# EAGLE board MainECU rev9 (EAGLE 9.5.0), part 1 of 2
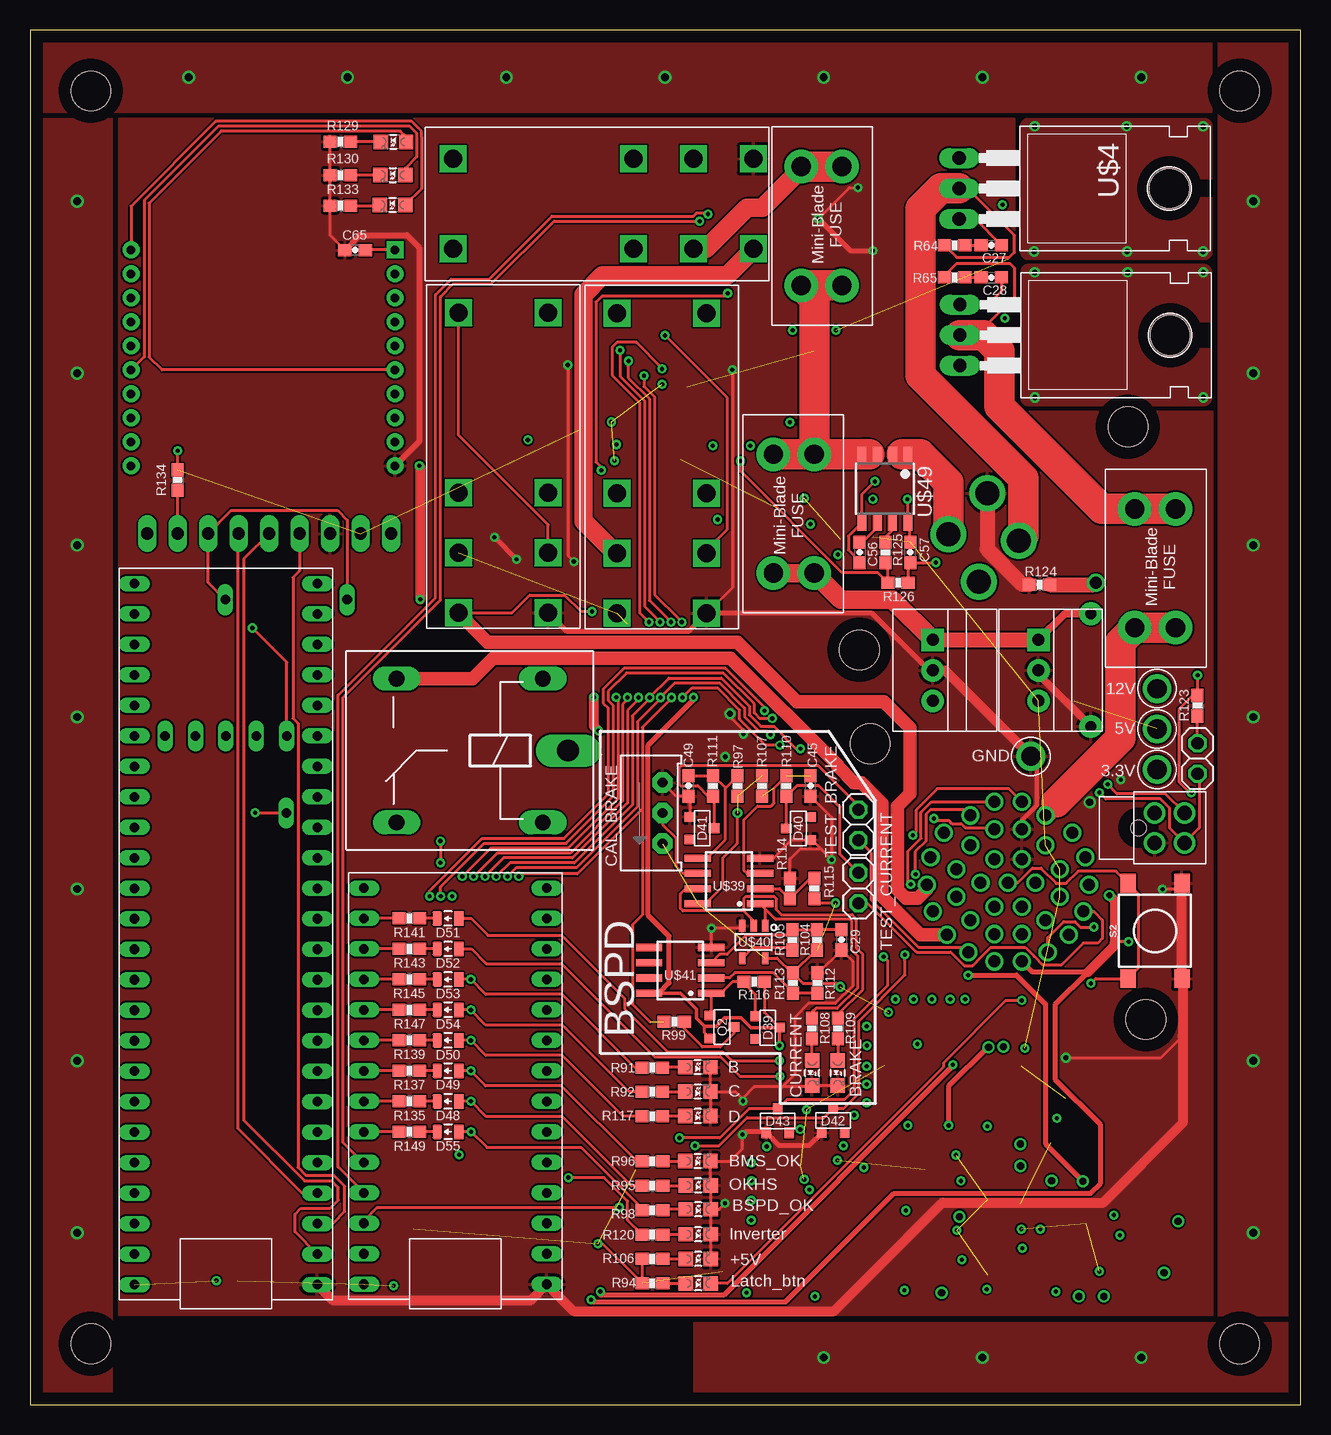
[diagram p4: board, top side]
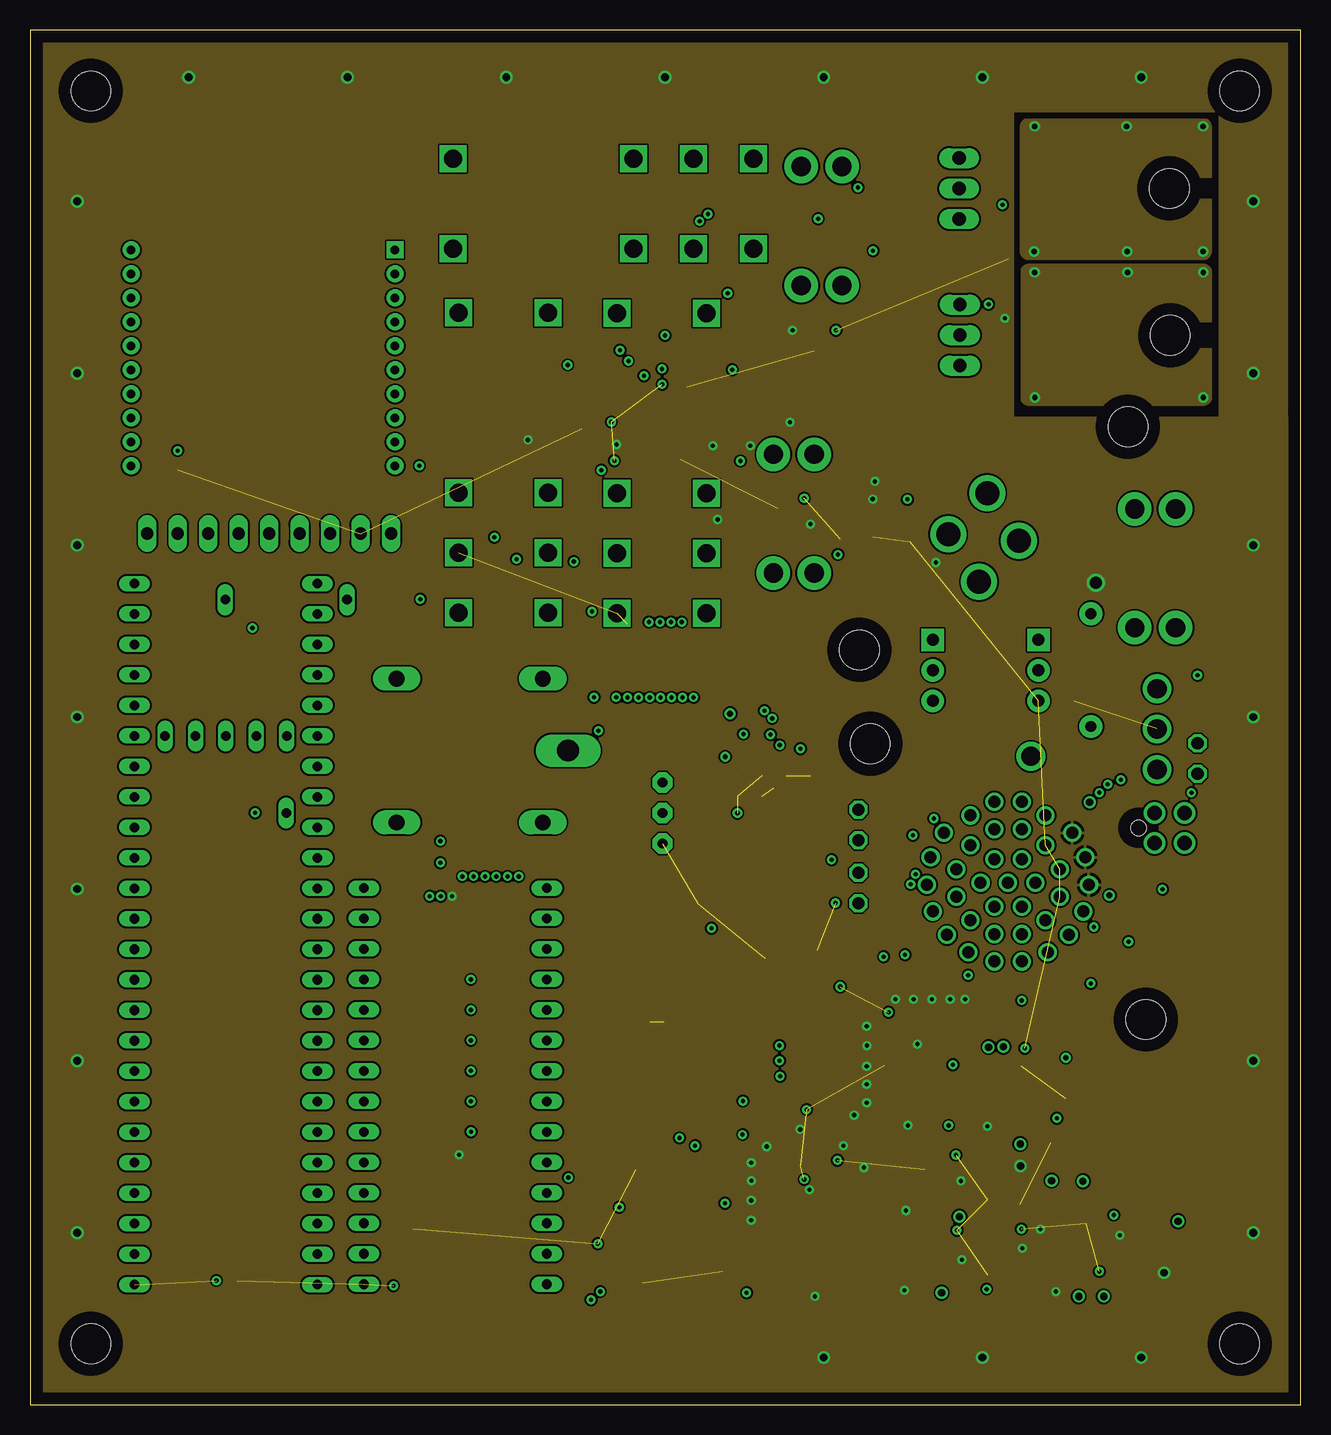
[diagram p5: board, inner layer Route2]
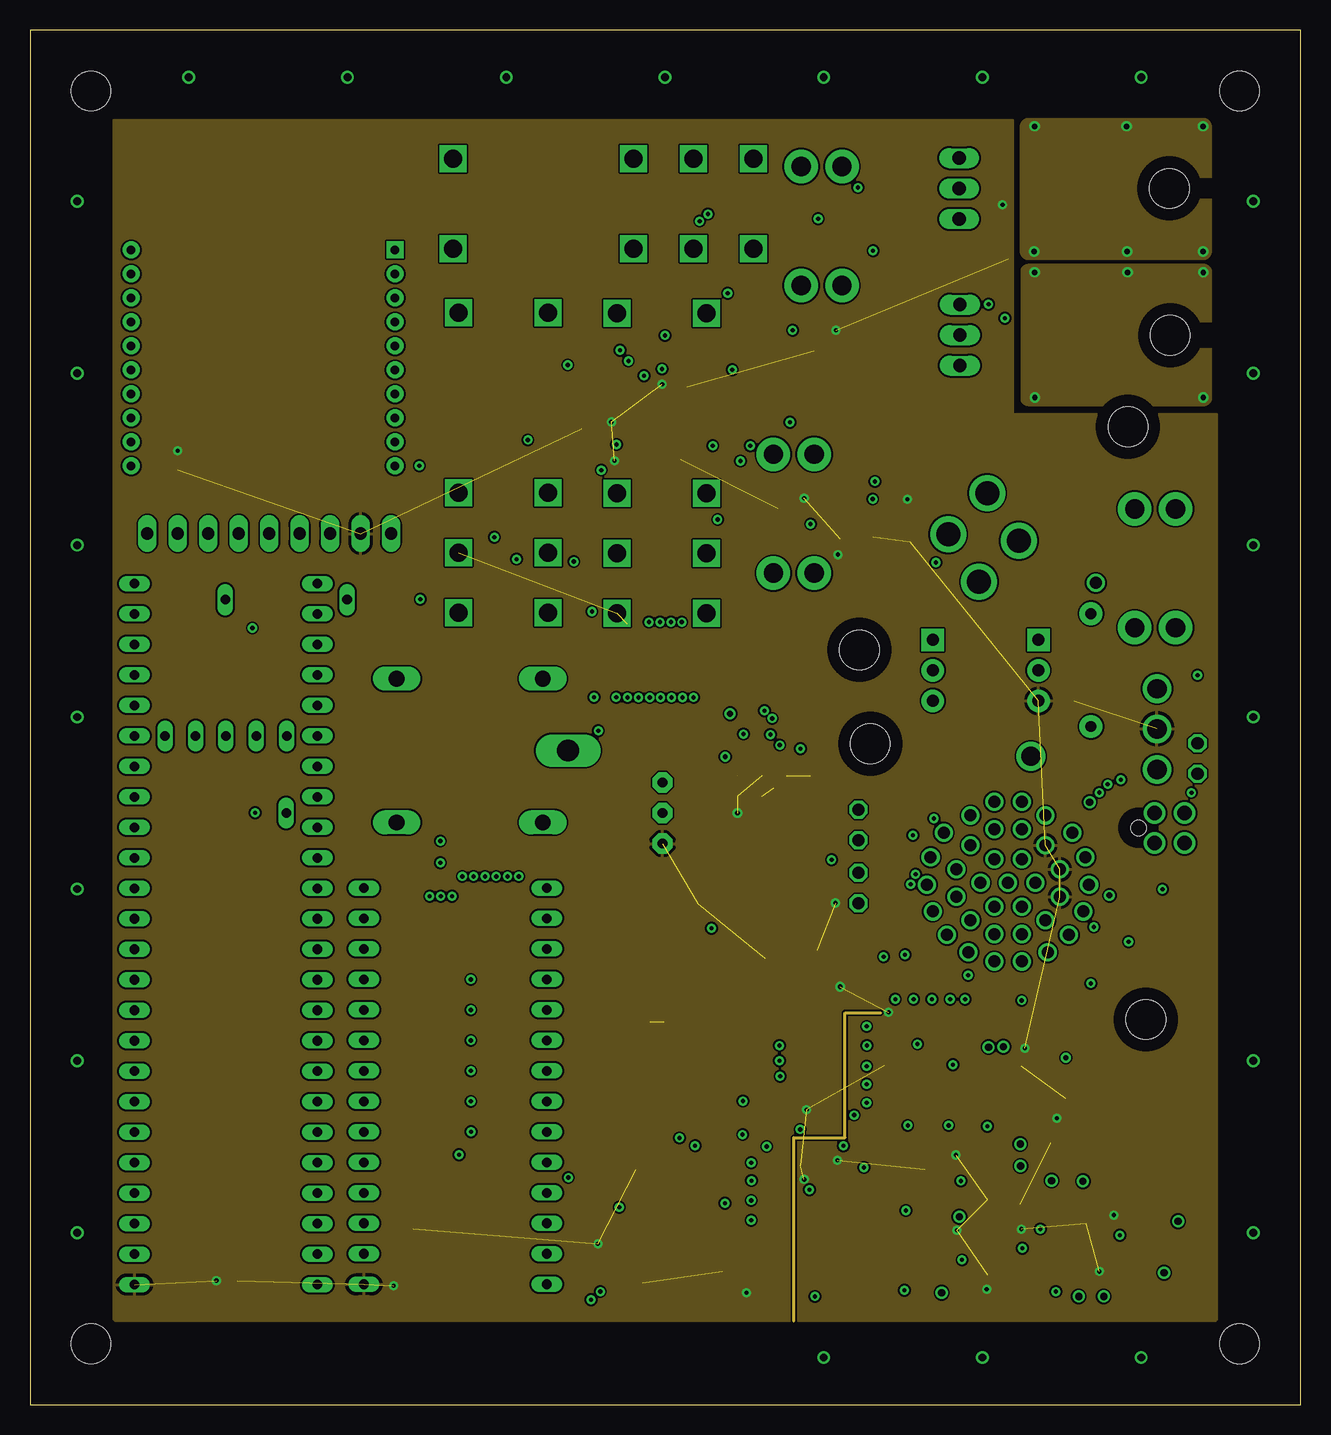
[diagram p6: board, inner layer Route15]
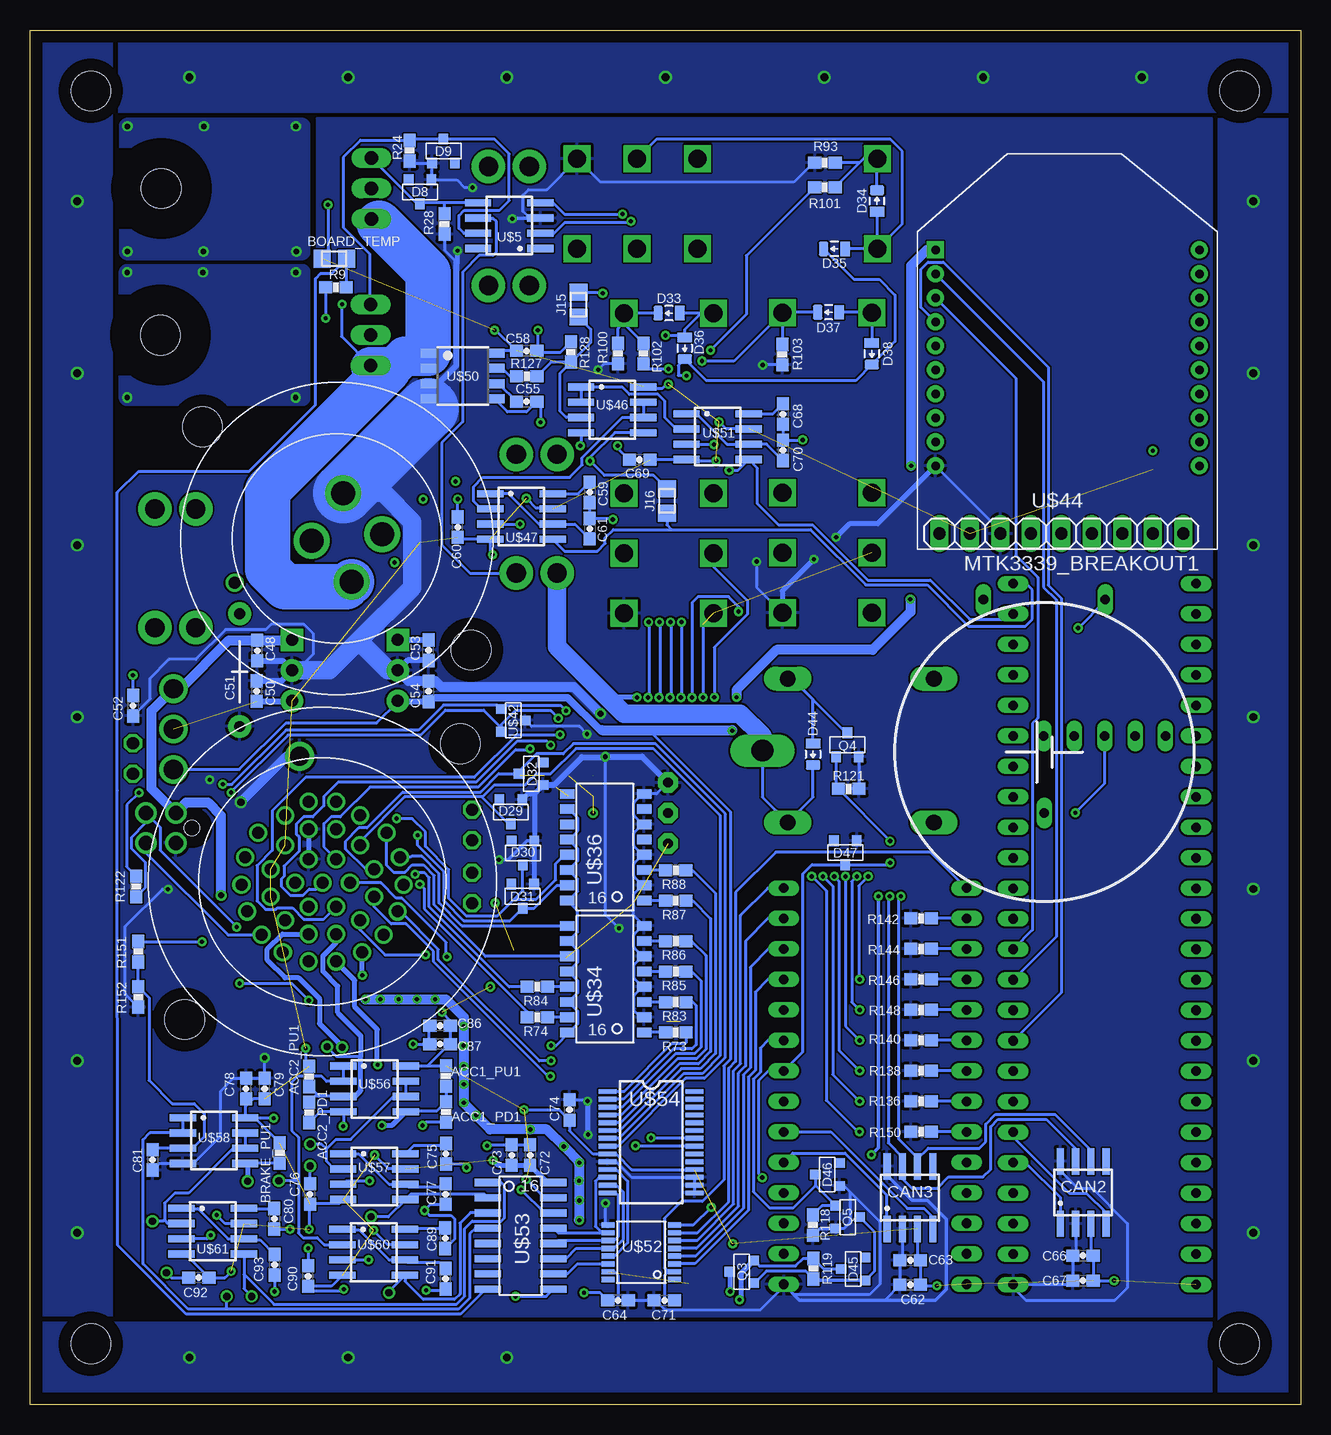
[diagram p7: board, bottom side, seen from below]

Size 105.92 x 114.55 mm. Coordinates in mm from the lower left corner, seen from the top.
Outline: 0,0 105.92,0 105.92,114.55 0,114.55 0,0
Copper layers (1+2*15+16): Top 0.035mm / dielectric 0.18mm / Route2 0.017mm / dielectric 1.12mm / Route15 0.017mm / dielectric 0.18mm / Bottom 0.035mm
Design rules "DRC JLC 4-layer": minimum track width 6mil, minimum drill 10mil, track to track 6mil, track to pad 6mil, pad to pad 6mil, via to via 6mil, smd to smd 6mil, copper to edge 40mil, drill to drill 6mil, minimum pad ring 10mil, minimum via ring 8mil, stop-mask expansion 4mil, vias tented up to drill 0mil, thermal gap 10mil
Holes 3.3 mm at 100.84,5.08 5.08,5.08 5.08,109.47 100.84,109.47

## Footprints (pad centres in the part's own frame; a part is rotated, then mirrored left to right if it is on the bottom)
TEST_POINT = drill 1.6: P$1 0,0
MINI-BLADE_FUSE_HOLDER = drill 1.613 pad 2.794: L1 0,3.404; L2 0,0; R1 9.906,3.404; R2 9.906,0
0603-RES = smd 1.1 x 1: 1 -0.85,0; 2 0.85,0
0805 = smd 1.4 x 1.5: 1 -1.025,0; 2 1.025,0
0603-CAP = smd 1.1 x 1: 1 -0.85,0; 2 0.85,0
CAP-PTH-LARGE = drill 0.9 pad 1.905: 1 -4.826,0; 2 4.572,0
TRIMPOT_3296 = drill 0.813 pad 1.676 octagon: 1 2.54,1.27; 2 0,1.27; 3 -2.54,1.27
SOIC-08 = smd 0.6 x 2.2: 1 -1.905,-2.6; 2 -0.635,-2.6; 3 0.635,-2.6; 4 1.905,-2.6; 5 1.905,2.6; 6 0.635,2.6; 7 -0.635,2.6; 8 -1.905,2.6
1X02_SLIM = drill 1.016 octagon: 1 -1.27,0; 2 1.27,0
SOT23 = smd 0.8 x 0.9: 1 -0.95,-1; 2 0.95,-1; 3 0,1
0805_D = smd 0.8 x 1.2: A -0.9,0; C 0.9,0
RELAY_DPDT = drill 1.5 square: 2 10.008,0; 3 5.004,0; 4 0,0; 5 0,7.493; 6 5.004,7.493; 7 10.008,7.493; COIL+ 25.019,0; COIL- 25.019,7.493
ZF112 = drill 1.321 long: 1 4.064,14.884; 2 4.064,2.896; O 16.256,14.884; S 16.256,2.896 | drill 1.803 long: P 1.956,8.89
LED-805 = smd 1.2 x 1.2: A 0,-1.05; C 0,1.05
1X09 = drill 1.016 long: 1 -8.89,0; 2 -6.35,0; 3 -3.81,0; 4 -1.27,0; 5 1.27,0; 6 3.81,0; 7 6.35,0; 8 8.89,0; 9 11.43,0
OKI-78SR = drill 1 pad 1.88 square: 1 -2.54,0 | drill 1 pad 1.88: 2 0,0; 3 2.54,0
TACTILE_SWITCH_SMD_6.2MM_TALL = smd 1.55 x 1.3: A1 -3.975,-2.25; A2 3.975,-2.25; B1 -3.975,2.25; B2 3.975,2.25
TO-220-H-HOLE = drill 1.118 long: 1 -2.54,-6.35; 2 0,-6.35; 3 2.54,-6.35 | hole 3.302: 0,11.176
11-11F1 = smd 0.8 x 1.2: 1 -4.445,-3.277; 2 -3.175,-3.277; 3 -1.905,-3.277; 4 -0.635,-3.277; 5 0.635,-3.277; 6 1.905,-3.277; 7 3.175,-3.277; 8 4.445,-3.277; 9 4.445,3.15; 10 3.175,3.15; 11 1.905,3.15; 12 0.635,3.15; 13 -0.635,3.15; 14 -1.905,3.15; 15 -3.175,3.15; 16 -4.445,3.15
SOT-23-5 = smd 1 x 0.55: 1 -1.35,0.95; 2 -1.35,0; 3 -1.35,-0.95; 4 1.35,-0.95; 5 1.35,0.95
TEENSY_3.5_EXT = drill 0.8 long: 3.3V 16.51,54.61; 3.3V_1 1.27,24.13; 3.3V_2 6.35,13.97; A0 16.51,29.21; A1 16.51,31.75; A2 16.51,34.29; A3 16.51,36.83; A4 16.51,39.37; A5 16.51,41.91; A6 16.51,44.45; A7 16.51,46.99; A8 16.51,49.53; A9 16.51,52.07; A12 1.27,3.81; A13 1.27,1.27; A14 16.51,1.27; A15 16.51,3.81; A16 16.51,6.35; A17 16.51,8.89; A18 16.51,11.43; A19 16.51,13.97; A20 16.51,16.51; A21 16.51,19.05; A22 16.51,21.59; AGND 16.51,57.15; D0(RX1) 1.27,57.15; D1(TX1) 1.27,54.61; D2 1.27,52.07; D3(CANTX) 1.27,49.53; D4(CANRX) 1.27,46.99; D5 1.27,44.45; D6 1.27,41.91; D7(RX3) 1.27,39.37; D8(TX3) 1.27,36.83; D9(RX2) 1.27,34.29; D10(TX2) 1.27,31.75; D11 1.27,29.21; D12 1.27,26.67; D13 16.51,26.67; D24 1.27,21.59; D25 1.27,19.05; D26 1.27,16.51; D27 1.27,13.97; D28 1.27,11.43; D29 1.27,8.89; D30 1.27,6.35; GND 1.27,59.69; GND_1 16.51,24.13; GND_2 8.89,13.97; PROG 11.43,13.97; RST 13.97,13.97; VBAT 3.81,13.97; VIN 16.51,59.69
XBEE = drill 0.7 pad 1.422 square: 1 -11,5.5 | drill 0.7 pad 1.422: 2 -11,3.5; 3 -11,1.5; 4 -11,-0.5; 5 -11,-2.5; 6 -11,-4.5; 7 -11,-6.5; 8 -11,-8.5; 9 -11,-10.5; 10 -11,-12.5; 11 11,-12.5; 12 11,-10.5; 13 11,-8.5; 14 11,-6.5; 15 11,-4.5; 16 11,-2.5; 17 11,-0.5; 18 11,1.5; 19 11,3.5; 20 11,5.5
CR-2450/G1AN = drill 0.8 long: +_0 -5.08,12.7; +_1 5.08,12.7; - 0,-5.08
TEENSY_3.2_SIMPLE = drill 0.8 long: 3.3V 16.51,29.21; A0 16.51,3.81; A1 16.51,6.35; A2 16.51,8.89; A3 16.51,11.43; A4 16.51,13.97; A5 16.51,16.51; A6 16.51,19.05; A7 16.51,21.59; A8 16.51,24.13; A9 16.51,26.67; AGND 16.51,31.75; D0(RX1) 1.27,31.75; D1(TX1) 1.27,29.21; D2 1.27,26.67; D3(CANTX) 1.27,24.13; D4(CANRX) 1.27,21.59; D5 1.27,19.05; D6 1.27,16.51; D7(RX3) 1.27,13.97; D8(TX3) 1.27,11.43; D9(RX2) 1.27,8.89; D10(TX2) 1.27,6.35; D11 1.27,3.81; D12 1.27,1.27; D13 16.51,1.27; GND 1.27,34.29; VIN 16.51,34.29
SOP8 = smd 0.76 x 1.27: 1 -1.905,-2.86; 2 -0.635,-2.86; 3 0.635,-2.86; 4 1.905,-2.86; 5 1.905,2.86; 6 0.635,2.86; 7 -0.635,2.86; 8 -1.905,2.86
TSSOP-16 = smd 0.45 x 1.1: 1 -2.275,-2.618; 2 -1.625,-2.618; 3 -0.975,-2.618; 4 -0.325,-2.618; 5 0.325,-2.618; 6 0.975,-2.618; 7 1.625,-2.618; 8 2.275,-2.618; 9 2.275,2.918; 10 1.625,2.918; 11 0.975,2.918; 12 0.325,2.918; 13 -0.325,2.918; 14 -0.975,2.918; 15 -1.625,2.918; 16 -2.275,2.918
SOIC-16 = smd 0.6 x 2.2: 1 -4.445,-2.794; 2 -3.175,-2.794; 3 -1.905,-2.794; 4 -0.635,-2.794; 5 0.635,-2.794; 6 1.905,-2.794; 7 3.175,-2.794; 8 4.445,-2.794; 9 4.445,2.667; 10 3.175,2.667; 11 1.905,2.667; 12 0.635,2.667; 13 -0.635,2.667; 14 -1.905,2.667; 15 -3.175,2.667; 16 -4.445,2.667
SSOP28 = smd 0.4 x 1.5: 1 -4.225,-3.625; 2 -3.575,-3.625; 3 -2.925,-3.625; 4 -2.275,-3.625; 5 -1.625,-3.625; 6 -0.975,-3.625; 7 -0.325,-3.625; 8 0.325,-3.625; 9 0.975,-3.625; 10 1.625,-3.625; 11 2.275,-3.625; 12 2.925,-3.625; 13 3.575,-3.625; 14 4.225,-3.625; 15 4.225,3.625; 16 3.575,3.625; 17 2.925,3.625; 18 2.275,3.625; 19 1.625,3.625; 20 0.975,3.625; 21 0.325,3.625; 22 -0.325,3.625; 23 -0.975,3.625; 24 -1.625,3.625; 25 -2.275,3.625; 26 -2.925,3.625; 27 -3.575,3.625; 28 -4.225,3.625
AUTOSPORT_14-35 = drill 1: P$1 1.143,6.655; P$2 3.124,5.512; P$3 5.359,4.064; P$4 6.452,2.032; P$5 6.756,-0.254; P$6 6.274,-2.489; P$7 5.08,-4.445; P$8 3.302,-5.893; P$9 1.143,-6.655; P$10 -1.143,-6.655; P$11 -3.302,-5.893; P$12 -5.08,-4.445; P$13 -6.274,-2.489; P$14 -6.756,-0.254; P$15 -6.452,2.032; P$16 -5.359,4.064; P$17 -3.124,5.512; P$18 -1.143,6.655; P$19 1.143,4.369; P$20 3.124,3.023; P$21 4.318,1.016; P$22 4.318,-1.27; P$23 3.124,-3.226; P$24 1.143,-4.369; P$25 -1.143,-4.369; P$26 -3.124,-3.226; P$27 -4.318,-1.27; P$28 -4.318,1.016; P$29 -3.124,3.023; P$30 -1.143,4.369; P$31 1.143,1.88; P$32 2.286,-0.102; P$33 1.143,-2.083; P$34 -1.143,-2.083; P$35 -2.286,-0.102; P$36 -1.143,1.88; P$37 0,-0.102 | hole 3.3: -11.491,-11.491; 11.491,11.491
AUTOSPORT_12-04 = drill 2: P$1 0,3.81; P$2 3.708,0.889; P$3 0,-2.108; P$4 -3.708,0.889 | hole 3.3: -10.288,-10.288; 10.288,10.288
NANO-FIT_VERTICAL-4 = drill 1.2: P$1 -1.25,0; P$2 1.25,0; P$3 -1.25,2.5; P$4 1.25,2.5 | hole 1.3: 0,-1.34

## Placement (x,y rotation side)
3V3_TEST  [TEST_POINT]  93.95,52.93 90 top
5ABOARDFUSE1  [MINI-BLADE_FUSE_HOLDER]  61.98,79.2 270 top
5AFUSE1  [MINI-BLADE_FUSE_HOLDER]  95.5,64.74 90 top
5ASHUTDOWNFUSE1  [MINI-BLADE_FUSE_HOLDER]  67.69,93.27 90 top
ACC1_PD1  10k  [0603-RES]  71.25,24.38 270 bottom
ACC1_PU1  10k  [0603-RES]  71.25,27.38 90 bottom
ACC2_PD1  10k  [0603-RES]  82.65,24.36 270 bottom
ACC2_PU1  10k  [0603-RES]  82.65,27.36 90 bottom
BOARD_TEMP  THERMISTOR_NCP210805  [0805]  80.54,95.5 0 bottom
BRAKE_PU1  10k  [0603-RES]  85.09,20.95 90 bottom
C  12V_TEST  [TEST_POINT]  93.95,59.66 90 top
C27  [0603-CAP]  80.14,96.62 0 top
C28  [0603-CAP]  80.14,93.93 0 top
C29  0.47µ  [0603-CAP]  67.64,38.73 270 top
C45  2.2µ  [0603-CAP]  65.07,51.56 90 top
C48  10uF  [0603-CAP]  86.97,62.84 90 bottom
C49  2.2µ  [0603-CAP]  54.89,51.56 90 top
C50  10uF  [0603-CAP]  87.02,59.46 270 bottom
C51  470uF  [CAP-PTH-LARGE]  88.44,61.09 270 bottom
C52  4.7nF  [0603-CAP]  97.33,58.24 270 bottom
C53  10uF  [0603-CAP]  72.69,62.86 90 bottom
C54  10uF  [0603-CAP]  72.69,59.44 270 bottom
C55  47nF  [0603-CAP]  64.52,83.59 0 bottom
C56  47nF  [0603-CAP]  69.16,71.02 270 top
C57  0.1uF  [0603-CAP]  73.38,71.02 90 top
C58  0.1uF  [0603-CAP]  64.52,87.81 180 bottom
C59  470pF  [0603-CAP]  59.26,76.02 270 bottom
C60  .1uF  [0603-CAP]  70.26,73.13 90 bottom
C61  .1uF  [0603-CAP]  59.26,73 270 bottom
C62  1uF  [0603-CAP]  32.54,9.98 0 bottom
C63  .1uF  [0603-CAP]  32.54,12.04 0 bottom
C64  .1uF  [0603-CAP]  56.9,8.69 180 bottom
C65  0.1uF  [0603-CAP]  27.1,96.22 180 top
C66  1uF  [0603-CAP]  18.14,12.42 0 bottom
C67  .1uF  [0603-CAP]  18.14,10.34 0 bottom
C68  470pF  [0603-CAP]  43.15,82.55 270 bottom
C69  .1uF  [0603-CAP]  55.09,78.74 180 bottom
C70  .1uF  [0603-CAP]  43.15,79.53 270 bottom
C71  .1uF  [0603-CAP]  53.04,8.69 0 bottom
C72  1uF  [0603-CAP]  64.21,20.8 270 bottom
C73  0.1uF  [0603-CAP]  65.76,20.8 270 bottom
C74  0.1uF  [0603-CAP]  60.93,24.56 90 bottom
C75  470pF  [0603-CAP]  71.25,20.9 270 bottom
C76  .1uF  [0603-CAP]  82.58,17.55 90 bottom
C77  .1uF  [0603-CAP]  71.27,17.55 90 bottom
C78  1uF  [0603-CAP]  87.91,26.34 90 bottom
C79  .1uF  [0603-CAP]  86.36,26.34 90 bottom
C80  470pF  [0603-CAP]  85.55,15.49 270 bottom
C81  1uF  [0603-CAP]  95.71,20.4 270 bottom
C86  1uF  [0603-CAP]  71.73,31.57 180 bottom
C87  .1uF  [0603-CAP]  71.73,30.05 180 bottom
C89  470pF  [0603-CAP]  71.3,13.87 270 bottom
C90  .1uF  [0603-CAP]  82.73,10.72 90 bottom
C91  .1uF  [0603-CAP]  71.27,10.49 90 bottom
C92  .1uF  [0603-CAP]  91.85,10.59 180 bottom
C93  .1uF  [0603-CAP]  85.52,11.66 90 bottom
CAL_BRAKE  [TRIMPOT_3296]  51.46,49.3 270 top
CAN2  MCP2551  [SOIC-08]  18.11,17.68 0 bottom
CAN3  MCP2551  [SOIC-08]  32.56,17.25 0 bottom
CAN_TERM_JMP1  M02_SLIM  [1X02_SLIM]  97.33,53.85 90 top
D8  MMBZ5246BLT1G  [SOT23]  73.41,101.07 180 bottom
D9  MMBZ5246BLT1G  [SOT23]  71.45,104.47 0 bottom
D29  MMBZ5246BLT1G  [SOT23]  65.84,49.4 180 bottom
D30  MMBZ5246BLT1G  [SOT23]  64.82,45.97 180 bottom
D31  MMBZ5246BLT1G  [SOT23]  64.85,42.37 180 bottom
D32  MMBZ5246BLT1G  [SOT23]  64.13,52.58 90 bottom
D33  TS4148 RYG  [0805_D]  52.65,90.96 180 bottom
D34  TS4148 RYG  [0805_D]  35.31,100.3 90 bottom
D35  TS4148 RYG  [0805_D]  38.86,96.32 180 bottom
D36  TS4148 RYG  [0805_D]  51.33,88.04 270 bottom
D37  TS4148 RYG  [0805_D]  39.34,91.03 180 bottom
D38  TS4148 RYG  [0805_D]  35.74,87.58 270 bottom
D39  MMBZ5246BLT1G  [SOT23]  61.49,31.42 270 top
D40  MMBZ5246BLT1G  [SOT23]  64.06,48.01 90 top
D41  MMBZ5246BLT1G  [SOT23]  56.03,48.03 270 top
D42  MMBZ5246BLT1G  [SOT23]  66.95,23.67 0 top
D43  MMBZ5246BLT1G  [SOT23]  62.33,23.65 0 top
D44  TS4148 RYG  [0805_D]  40.64,54.2 270 bottom
D45  MMBZ5246BLT1G  [SOT23]  37.29,11.3 90 bottom
D46  MMBZ5246BLT1G  [SOT23]  39.45,19.18 90 bottom
D47  MMBZ5246BLT1G  [SOT23]  37.95,46 180 bottom
D48  TS4148 RYG  [0805_D]  34.85,25.27 180 top
D49  TS4148 RYG  [0805_D]  34.85,27.81 180 top
D50  TS4148 RYG  [0805_D]  34.85,30.35 180 top
D51  TS4148 RYG  [0805_D]  34.85,40.51 180 top
D52  TS4148 RYG  [0805_D]  34.85,37.97 180 top
D53  TS4148 RYG  [0805_D]  34.85,35.43 180 top
D54  TS4148 RYG  [0805_D]  34.85,32.89 180 top
D55  TS4148 RYG  [0805_D]  34.85,22.73 180 top
IMD_SHUTDOWN_RLY1  RT424009  [RELAY_DPDT]  60.3,103.81 180 top
INVERTER_PWR_RELAY1  G5LE  [ZF112]  46.81,63.4 180 top
J15  JUMPER  [0805]  60.2,91.67 270 bottom
J16  JUMPER  [0805]  52.83,75.31 90 bottom
LED12  White  [LED-805]  55.7,10.11 270 top
LED19  Green  [LED-805]  55.68,20.29 270 top
LED21  Yellow  [LED-805]  55.68,28.12 270 top
LED22  Green  [LED-805]  55.68,26.09 270 top
LED23  Yellow  [LED-805]  55.7,18.26 270 top
LED24  Yellow  [LED-805]  65.2,27.64 180 top
LED25  Red  [LED-805]  55.7,16.28 270 top
LED26  Purple  [LED-805]  55.7,12.14 270 top
LED27  Red  [LED-805]  55.7,14.2 270 top
LED28  RED  [LED-805]  67.34,27.64 180 top
LED29  Red  [LED-805]  55.68,24.05 270 top
LED30  Green  [LED-805]  30.3,105.23 90 top
LED31  Red  [LED-805]  30.25,102.46 90 top
LED32  Blue  [LED-805]  30.23,99.97 90 top
MTK3339_BREAKOUT1  [1X09]  18.67,72.59 180 bottom
Q2  P-CHANNEL_MOSFET_DMP3099L-7  [SOT23]  57.68,31.47 270 top
Q3  P-CHANNEL_MOSFET_DMP3099L-7  [SOT23]  46.58,11.07 90 bottom
Q4  [SOT23]  37.77,54.99 0 bottom
Q5  [SOT23]  37.74,15.62 270 bottom
R9  43k  [0603-RES]  80.42,93.12 0 bottom
R24  10k  [0603-RES]  74.27,104.5 90 bottom
R28  10k  [0603-RES]  71.37,98.4 90 bottom
R64  [0603-RES]  77.09,96.62 0 top
R65  [0603-RES]  77.09,93.93 0 top
R73  150  [0603-RES]  52.07,31.01 180 bottom
R74  0  [0603-RES]  63.63,32.28 180 bottom
R83  150  [0603-RES]  52.07,33.55 180 bottom
R84  0  [0603-RES]  63.63,34.82 180 bottom
R85  150  [0603-RES]  52.1,36.09 180 bottom
R86  150  [0603-RES]  52.1,38.63 180 bottom
R87  150  [0603-RES]  52.07,41.99 180 bottom
R88  150  [0603-RES]  52.1,44.53 180 bottom
R91  2k  [0603-RES]  51.87,28.09 0 top
R92  20k  [0603-RES]  51.87,26.06 0 top
R93  2k  [0603-RES]  39.65,103.51 0 bottom
R94  5.1k  [0603-RES]  51.89,10.11 0 top
R95  2k  [0603-RES]  51.89,18.24 0 top
R96  2k  [0603-RES]  51.89,20.27 0 top
R97  10k  [0603-RES]  58.98,51.56 270 top
R98  6.8k  [0603-RES]  51.89,16.21 0 top
R99  68  [0603-RES]  53.7,31.9 180 top
R100  2k  [0603-RES]  56.9,87.58 90 bottom
R101  20  [0603-RES]  39.65,101.45 180 bottom
R102  20  [0603-RES]  54.76,87.58 270 bottom
R103  2k  [0603-RES]  43.21,87.5 90 bottom
R104  680k  [0603-RES]  65.61,38.73 270 top
R105  330  [0603-RES]  63.58,38.73 270 top
R106  270  [0603-RES]  51.89,12.14 0 top
R107  10k  [0603-RES]  61.01,51.56 270 top
R108  2k  [0603-RES]  65.2,31.34 270 top
R109  6.8k  [0603-RES]  67.36,31.34 270 top
R110  100  [0603-RES]  63.04,51.56 90 top
R111  100  [0603-RES]  56.95,51.56 90 top
R112  12k  [0603-RES]  65.63,35.13 270 top
R113  4k  [0603-RES]  63.6,35.13 90 top
R114  20k  [0603-RES]  63.35,43 270 top
R115  12k  [0603-RES]  65.38,43 270 top
R116  10k  [0603-RES]  60.38,35.23 180 top
R117  6.8k  [0603-RES]  51.87,24.03 0 top
R118  10k  [0603-RES]  40.64,14.96 90 bottom
R119  10k  [0603-RES]  40.61,11.33 270 bottom
R120  1.2k  [0603-RES]  51.89,14.17 0 top
R121  10k  [0603-RES]  37.67,51.31 0 bottom
R122  60  [0603-RES]  97.05,43.18 90 bottom
R123  60  [0603-RES]  97.33,58.24 270 top
R124  0  [0603-RES]  84.15,68.33 0 top
R125  1K  [0603-RES]  71.3,71.02 270 top
R126  2K  [0603-RES]  72.36,68.5 180 top
R127  1K  [0603-RES]  64.52,85.7 0 bottom
R128  2K  [0603-RES]  60.81,87.73 270 bottom
R129  33  [0603-RES]  25.88,105.23 0 top
R130  1.2k  [0603-RES]  25.88,102.46 0 top
R133  0  [0603-RES]  25.88,99.92 0 top
R134  10k  [0603-RES]  12.32,77.04 270 top
R135  43k  [0603-RES]  31.62,25.27 180 top
R136  12k  [0603-RES]  31.62,25.27 180 bottom
R137  43k  [0603-RES]  31.62,27.81 180 top
R138  12k  [0603-RES]  31.62,27.81 180 bottom
R139  43k  [0603-RES]  31.62,30.35 180 top
R140  12k  [0603-RES]  31.62,30.35 180 bottom
R141  43k  [0603-RES]  31.62,40.51 180 top
R142  12k  [0603-RES]  31.62,40.51 180 bottom
R143  43k  [0603-RES]  31.62,37.97 180 top
R144  12k  [0603-RES]  31.62,37.97 180 bottom
R145  43k  [0603-RES]  31.62,35.43 180 top
R146  12k  [0603-RES]  31.62,35.43 180 bottom
R147  43k  [0603-RES]  31.62,32.89 180 top
R148  12k  [0603-RES]  31.62,32.89 180 bottom
R149  43k  [0603-RES]  31.62,22.73 180 top
R150  12k  [0603-RES]  31.62,22.73 180 bottom
R151  43k  [0603-RES]  96.9,37.74 270 bottom
R152  12k  [0603-RES]  96.9,33.99 270 bottom
REG1  5V  [OKI-78SR]  84.07,61.19 270 top
REG3  3.3V  [OKI-78SR]  75.26,61.19 270 top
S2  [TACTILE_SWITCH_SMD_6.2MM_TALL]  93.78,39.47 90 top
TEST_BRAKE  M02_SLIM  [1X02_SLIM]  69.06,48.31 270 top
TEST_CURRENT  M02_SLIM  [1X02_SLIM]  69.06,43.05 90 top
U$4  N-CHANNEL_MOSFET_IRF1324PBF  [TO-220-H-HOLE]  83.79,101.35 270 top
U$5  MC34152  [SOIC-08]  65.96,98.25 90 bottom
U$7  N-CHANNEL_MOSFET_IRF1324PBF  [TO-220-H-HOLE]  83.87,89.13 270 top
U$15  [TEST_POINT]  93.95,56.31 90 top
U$19  [TEST_POINT]  83.44,54.03 270 top
U$34  TLP291-4  [11-11F1]  57.99,35.46 90 bottom
U$36  TLP291-4  [11-11F1]  57.99,46.46 90 bottom
U$37  RT424009  [RELAY_DPDT]  43.21,65.99 90 top
U$38  RT424009  [RELAY_DPDT]  56.41,65.94 90 top
U$39  MCP6542SOIC  [SOIC-08]  58.27,43.64 90 top
U$40  SN74AHC1G09  [SOT-23-5]  60.33,38.56 270 top
U$41  NE5532SOIC  [SOIC-08]  54.2,36.2 90 top
U$42  CDSOT23-T24CAN-Q  [SOT23]  65.63,57.02 270 bottom
U$43  TEENSY_3.5_EXT  [TEENSY_3.5_EXT]  25.22,69.7 180 top
U$44  XBEE  [XBEE]  19.43,90.73 0 bottom
U$45  CR-2450/G1AN  [CR-2450/G1AN]  21.36,54.38 0 bottom
U$46  MCP6002SOIC  [SOIC-08]  57.38,82.91 270 bottom
U$47  [SOIC-08]  64.95,74.02 270 bottom
U$48  TEENSY_3.2_SIMPLE  [TEENSY_3.2_SIMPLE]  44.35,44.32 180 top
U$49  ACHS-7121  [SOP8]  71.27,76.33 180 top
U$50  ACHS-7121  [SOP8]  69.85,85.73 270 bottom
U$51  [SOIC-08]  48.59,80.67 270 bottom
U$52  TXB0106  [TSSOP-16]  54.81,12.7 90 bottom
U$53  MCP3208SOIC  [SOIC-16]  64.95,14.07 270 bottom
U$54  MCP23S17SSOP28  [SSOP28]  54.13,21.87 270 bottom
U$56  MCP6002SOIC  [SOIC-08]  77.19,26.31 270 bottom
U$57  [SOIC-08]  77.22,19 270 bottom
U$58  MCP6002SOIC  [SOIC-08]  90.58,22 270 bottom
U$60  [SOIC-08]  77.27,12.7 270 bottom
U$61  [SOIC-08]  90.68,14.45 270 bottom
X5  CONNECTOR-37  [AUTOSPORT_14-35]  81.53,43.59 0 bottom
X6  CONNECTOR-4AUTOSPORT  [AUTOSPORT_12-04]  80.34,72.19 275.3 bottom
X7  CONNECTOR-4NANO-FIT-VERTICAL-4  [NANO-FIT_VERTICAL-4]  93.75,48.06 270 top